# EAGLE design SPv2 (EAGLE 6.5.0)

## Sheet 1 of 2
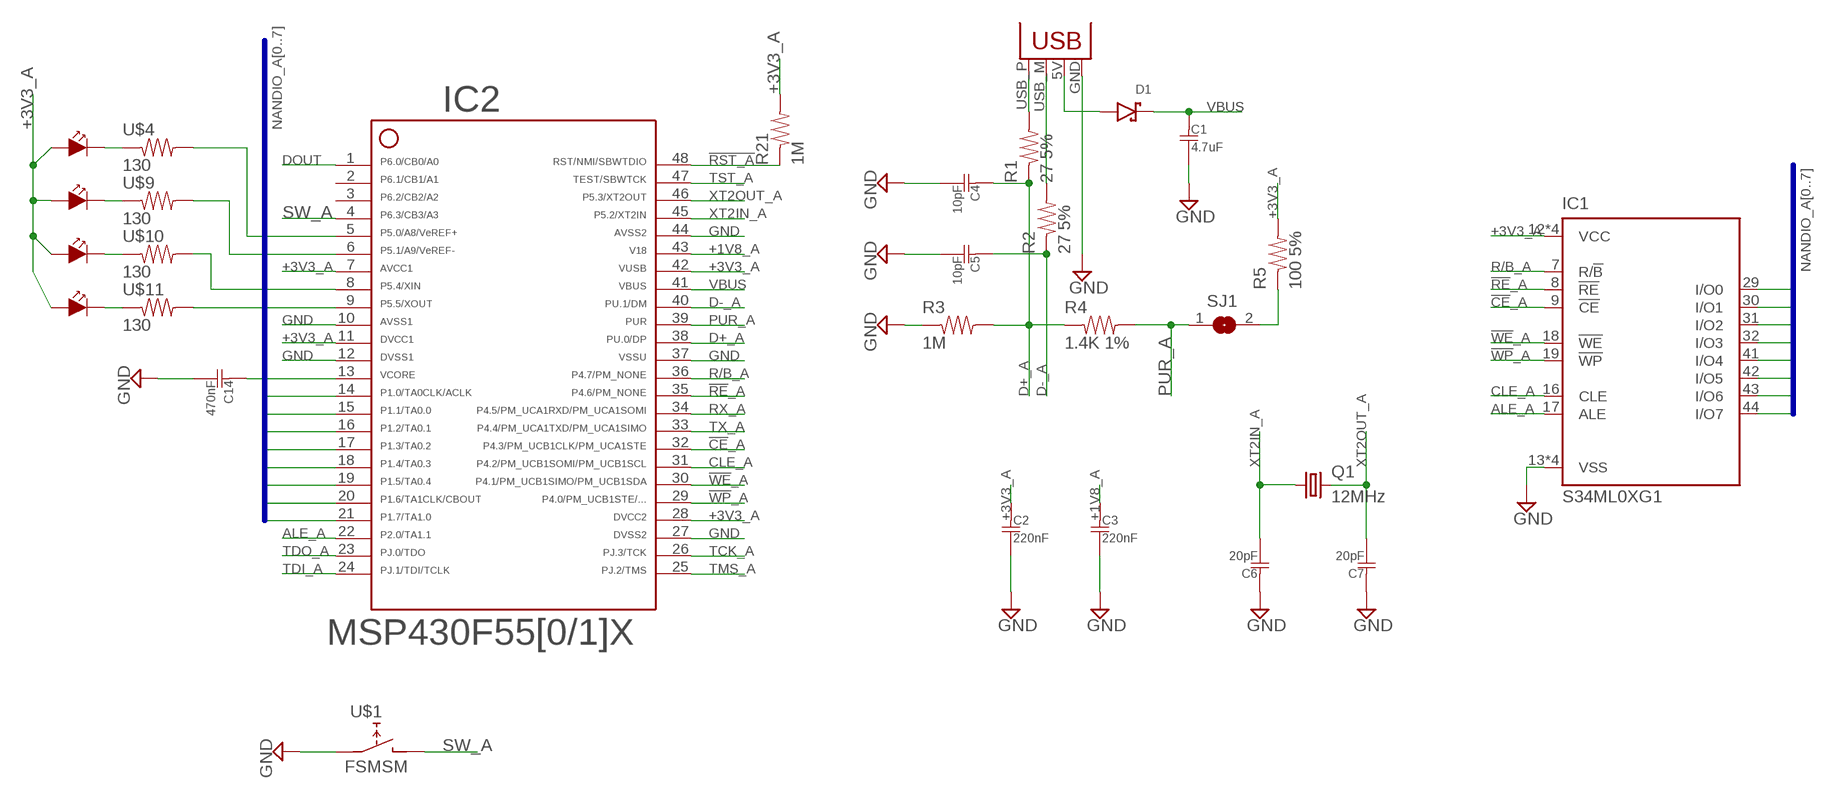
[diagram p0: schematic, sheet 1]

### Parts
C1  4.7uF  C0805  [R0805]
C2  220nF  C0805  [R0805]
C3  220nF  C0805  [R0805]
C4  10pF  C0805  [R0805]
C5  10pF  C0805  [R0805]
C6  20pF  C0805  [R0805]
C7  20pF  C0805  [R0805]
C14  470nF  C0805  [R0805]
D1  D-SCHOTTKY  [SOD123]
IC1  S34ML0XG1  [TSOP48]
IC2  F5508  F55[0/1]X---PT48  [PT48]
JP1  USBPCB  [USB-A-PCB]
Q1  12MHz  CRYSTALCSM-3X  [CSM-3X]
R1  27 5%  R0805  [R0805]
R2  27 5%  R0805  [R0805]
R3  1M  R0805  [R0805]
R4  1.4K 1%  R0805  [R0805]
R5  100 5%  R0805  [R0805]
R21  1M  R0805  [R0805]
SJ1  SJW  [SJW]
U$1  FSMSM  [FSMSM]
U$4  130  R0805  [R0805]
U$5  LED  [LED0805]
U$6  LED  [LED0805]
U$7  LED  [LED0805]
U$8  LED  [LED0805]
U$9  130  R0805  [R0805]
U$10  130  R0805  [R0805]
U$11  130  R0805  [R0805]

### Nets
!CE!_A: IC1.9(!CE) IC2.32
!RE!_A: IC1.8(!RE) IC2.35
!RST_A!: IC2.48 R21.P$1
!WE!_A: IC1.18(!WE) IC2.30
!WP!_A: IC1.19(!WP) IC2.29
+1V8_A: C3.P$1 IC2.43
+3V3_A: C2.P$1 IC1.12(VCC) IC1.34(VCC) IC1.37(VCC) IC1.39(VCC) IC2.7 IC2.11 IC2.28 IC2.42 R5.P$2 R21.P$2 U$5.ANODE U$6.ANODE U$7.ANODE U$8.ANODE
ALE_A: IC1.17(ALE) IC2.22
CLE_A: IC1.16(CLE) IC2.31
D+_A: C4.P$1 IC2.38 R1.P$1 R3.P$2 R4.P$1
D-_A: C5.P$1 IC2.40 R2.P$1
DOUT: IC2.1 ; also sheet 2
GND: C1.P$2 C2.P$2 C3.P$2 C4.P$2 C5.P$2 C6.P$1 C7.P$1 C14.P$2 IC1.13(VSS) IC1.25(VSS) IC1.36(VSS) IC1.48(VSS) IC2.10 IC2.12 IC2.27 IC2.37 IC2.44 JP1.GND R3.P$1 U$1.P$1(A1) ; also sheet 2
N$1: JP1.USB_P(D+) R1.P$2
N$2: JP1.USB_M(D-) R2.P$2
N$3: C14.P$1 IC2.13
N$4: R5.P$1 SJ1.2
N$19: IC2.9 U$11.P$2
N$22: U$7.CATHODE U$10.P$1
N$23: U$6.CATHODE U$9.P$1
N$24: U$4.P$1 U$5.CATHODE
N$25: U$8.CATHODE U$11.P$1
N$26: IC2.8 U$10.P$2
N$27: IC2.6 U$9.P$2
N$28: IC2.5 U$4.P$2
N$33: D1.ANODE JP1.5V(VBUS)
NANDIO_A0: IC1.29(I/O0) IC2.14
NANDIO_A1: IC1.30(I/O1) IC2.15
NANDIO_A2: IC1.31(I/O2) IC2.16
NANDIO_A3: IC1.32(I/O3) IC2.17
NANDIO_A4: IC1.41(I/O4) IC2.18
NANDIO_A5: IC1.42(I/O5) IC2.19
NANDIO_A6: IC1.43(I/O6) IC2.20
NANDIO_A7: IC1.44(I/O7) IC2.21
PUR_A: IC2.39 R4.P$2 SJ1.1
R/B_A: IC1.7(R/!B) IC2.36
RX_A: IC2.34 ; also sheet 2
SW_A: IC2.4 U$1.P$2(B)
TCK_A: IC2.26
TDI_A: IC2.24
TDO_A: IC2.23
TMS_A: IC2.25
TST_A: IC2.47
TX_A: IC2.33 ; also sheet 2
VBUS: C1.P$1 D1.CATHODE IC2.41 ; also sheet 2
XT2IN_A: C6.P$2 IC2.45 Q1.P$1
XT2OUT_A: C7.P$2 IC2.46 Q1.P$2
Unconnected: IC2.2 IC2.3

### Buses
NANDIO_A[0..7]

## Sheet 2 of 2
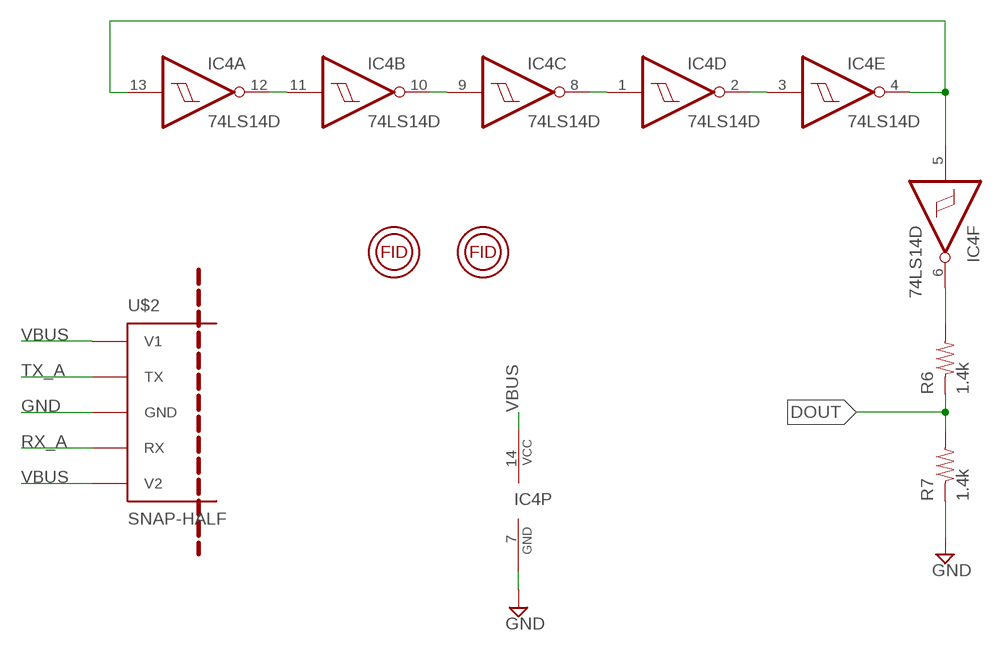
[diagram p1: schematic, sheet 2]

### Parts
IC4  74LS14D  [SO14]
R6  1.4k  R0805  [R0805]
R7  1.4k  R0805  [R0805]
U$2  SNAP-HALF  [SNAP-HALF]
U$3  FIDUCAL  [FIDUCAL]
U$12  FIDUCAL  [FIDUCAL]

### Nets
DOUT: R6.P$1 R7.P$2 ; also sheet 1
GND: IC4.7(P:GND) R7.P$1 U$2.P$3(GND) ; also sheet 1
N$5: IC4.11(B:I) IC4.12(A:O)
N$6: IC4.9(C:I) IC4.10(B:O)
N$7: IC4.1(D:I) IC4.8(C:O)
N$8: IC4.2(D:O) IC4.3(E:I)
N$9: IC4.4(E:O) IC4.5(F:I) IC4.13(A:I)
N$10: IC4.6(F:O) R6.P$2
RX_A: U$2.P$4(RX) ; also sheet 1
TX_A: U$2.P$2(TX) ; also sheet 1
VBUS: IC4.14(P:VCC) U$2.P$1(V1) U$2.P$5(V2) ; also sheet 1

## Library data of the parts
C1-C7 C14 = Passives:C
D1 = Passives:D-SCHOTTKY
IC1 = Flash:S34ML0XG1: Spansion 1GB, 2GB, and 4GB x8 NAND Flash Memory In x8 I/O mode
IC2 = TI_MSP430_v16:F55[0/1]X---PT48: ***F55[0/1/2]X*** PT48 Rev. 1.0 06/2010 "http://www.ti.com/lit/gpn/msp430f5509" Only for FF5504, F5508,F5509,F5510
IC4 = 74xx-us:74*14: Hex schmitt trigger INVERTER
JP1 = SparkFun-Connectors:USB: USB Connectors USB-B-PTH is fully proven SKU : PRT-00139/CONN-08278 USB-miniB is fully proven SKU : PRT-00587 USB-A-PCB is untested. USB-A-H is throughly reviewed, but untested. Spark Fun Electronics SKU : PRT-00437 USB-B-SMT is throughly reviewed, but untested. Needs silkscreen touching up. USB-A-S has not been used/tested USB-MB-H has not been used/tested USB-MICROB has been used. CONN-09505
Q1 = Passives:CRYSTAL: CRYSTAL
R1-R7 R21 U$4 U$9-U$11 = Passives:R: A standard resistor.
SJ1 = jumper:SJ: SMD solder JUMPER
U$1 = Passives:FSMSM
U$2 = Passives:SNAP-HALF
U$3 U$12 = Passives:FIDUCAL
U$5-U$8 = Passives:LED

## Board
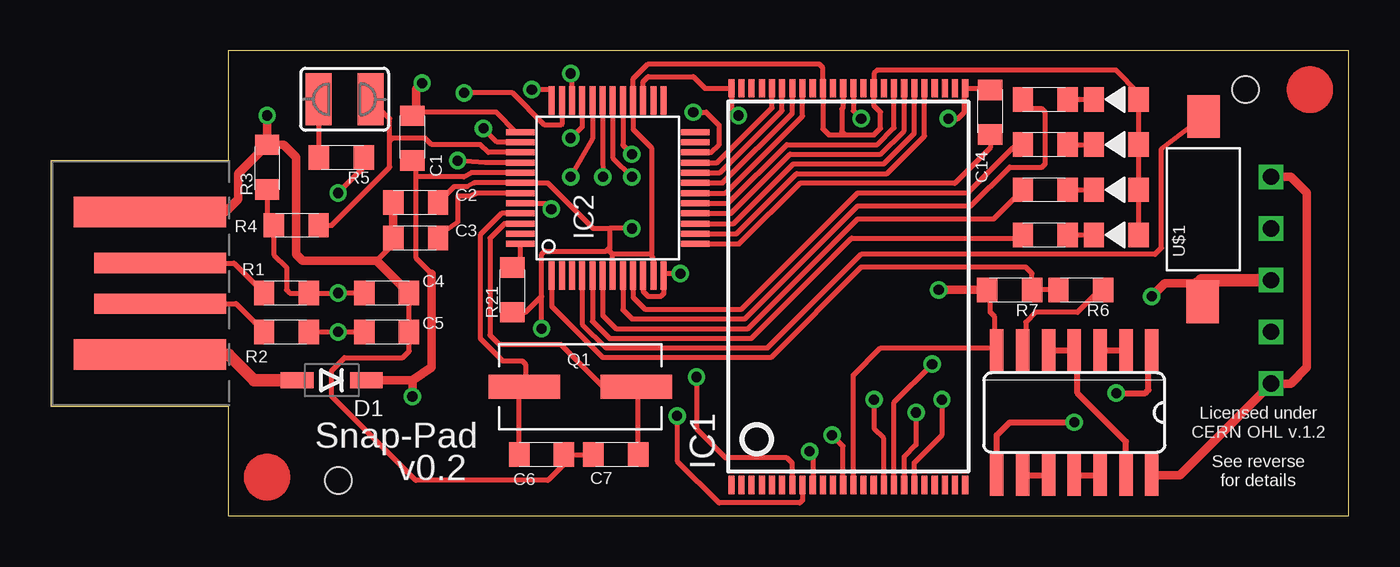
[diagram p2: board, top side]
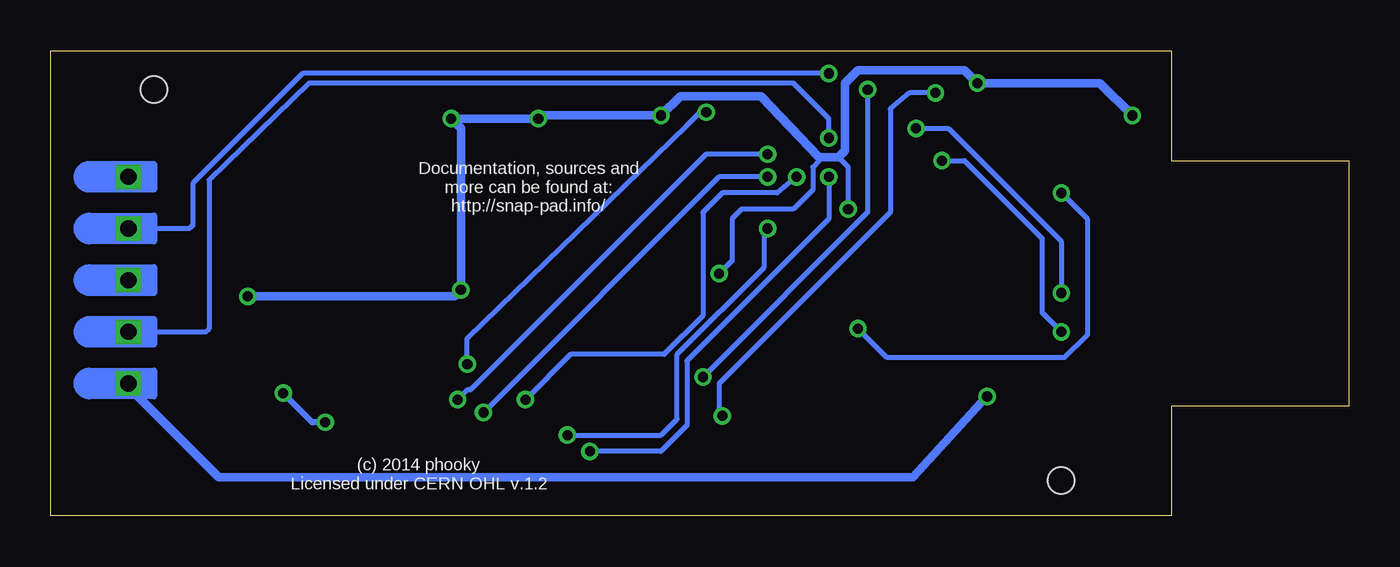
[diagram p3: board, bottom side, seen from below]

Size 63.82 x 22.86 mm. Coordinates in mm from the lower left corner, seen from the top.
Outline: 8.73,0 63.82,0 63.82,22.86 8.73,22.86 8.73,17.46 0,17.46 0,5.4 8.73,5.4 8.73,0
Copper layers (1*16): Top 0.0356mm / dielectric 1.5011mm / Bottom 0.0356mm
Design rules "LaenPCBOrder": minimum track width 6mil, minimum drill 13mil, track to track 6mil, track to pad 6mil, pad to pad 6mil, via to via 6mil, smd to smd 6mil, copper to edge 15mil, drill to drill 6mil, minimum pad ring 7mil, minimum via ring 7mil, stop-mask expansion 3mil, vias tented up to drill 0mil, thermal gap 10mil
Holes 1.3 mm at 14.13,1.75 58.74,20.95

### Footprints (pad centres in the part's own frame; a part is rotated, then mirrored left to right if it is on the bottom)
R0805 = smd 1 x 1.2: P$1 1.1,0; P$2 -1.1,0
SOD123 = smd 1.6 x 0.8: ANODE 1.7,0; CATHODE -1.7,0
TSOP48 = smd 0.9 x 0.3: 1 -9.75,5.75; 2 -9.75,5.25; 3 -9.75,4.75; 4 -9.75,4.25; 5 -9.75,3.75; 6 -9.75,3.25; 7 -9.75,2.75; 8 -9.75,2.25; 9 -9.75,1.75; 10 -9.75,1.25; 11 -9.75,0.75; 12 -9.75,0.25; 13 -9.75,-0.25; 14 -9.75,-0.75; 15 -9.75,-1.25; 16 -9.75,-1.75; 17 -9.75,-2.25; 18 -9.75,-2.75; 19 -9.75,-3.25; 20 -9.75,-3.75; 21 -9.75,-4.25; 22 -9.75,-4.75; 23 -9.75,-5.25; 24 -9.75,-5.75; 25 9.75,-5.75; 26 9.75,-5.25; 27 9.75,-4.75; 28 9.75,-4.25; 29 9.75,-3.75; 30 9.75,-3.25; 31 9.75,-2.75; 32 9.75,-2.25; 33 9.75,-1.75; 34 9.75,-1.25; 35 9.75,-0.75; 36 9.75,-0.25; 37 9.75,0.25; 38 9.75,0.75; 39 9.75,1.25; 40 9.75,1.75; 41 9.75,2.25; 42 9.75,2.75; 43 9.75,3.25; 44 9.75,3.75; 45 9.75,4.25; 46 9.75,4.75; 47 9.75,5.25; 48 9.75,5.75
PT48 = smd 1.4 x 0.3: 1 -4.3,2.75; 2 -4.3,2.25; 3 -4.3,1.75; 4 -4.3,1.25; 5 -4.3,0.75; 6 -4.3,0.25; 7 -4.3,-0.25; 8 -4.3,-0.75; 9 -4.3,-1.25; 10 -4.3,-1.75; 11 -4.3,-2.25; 12 -4.3,-2.75; 25 4.3,-2.75; 26 4.3,-2.25; 27 4.3,-1.75; 28 4.3,-1.25; 29 4.3,-0.75; 30 4.3,-0.25; 31 4.3,0.25; 32 4.3,0.75; 33 4.3,1.25; 34 4.3,1.75; 35 4.3,2.25; 36 4.3,2.75 | smd 0.3 x 1.4: 13 -2.75,-4.3; 14 -2.25,-4.3; 15 -1.75,-4.3; 16 -1.25,-4.3; 17 -0.75,-4.3; 18 -0.25,-4.3; 19 0.25,-4.3; 20 0.75,-4.3; 21 1.25,-4.3; 22 1.75,-4.3; 23 2.25,-4.3; 24 2.75,-4.3; 37 2.75,4.3; 38 2.25,4.3; 39 1.75,4.3; 40 1.25,4.3; 41 0.75,4.3; 42 0.25,4.3; 43 -0.25,4.3; 44 -0.75,4.3; 45 -1.25,4.3; 46 -1.75,4.3; 47 -2.25,4.3; 48 -2.75,4.3
SO14 = smd 0.66 x 2.032: 1 -3.81,-3.073; 2 -2.54,-3.073; 3 -1.27,-3.073; 4 0,-3.073; 5 1.27,-3.073; 6 2.54,-3.073; 7 3.81,-3.073; 8 3.81,3.073; 9 2.54,3.073; 10 1.27,3.073; 11 0,3.073; 12 -1.27,3.073; 13 -2.54,3.073; 14 -3.81,3.073
USB-A-PCB = smd 7.5 x 1.5: 5V -0.2,-3.5; GND -0.2,3.5 | smd 6.5 x 1: USB_M 0.3,-1; USB_P 0.3,1
CSM-3X = smd 3.5 x 1.2: P$1 -2.75,0; P$2 2.75,0
SJW = smd 1.27 x 2.54: 1 -1.27,0; 2 1.27,0
FSMSM = smd 2.1 x 1.6: P$1 -4.55,0.05; P$2 4.55,0
SNAP-HALF = drill 0.8 square: P$1 -3.81,5.08; P$2 -3.81,2.54; P$3 -3.81,0; P$4 -3.81,-2.54; P$5 -3.81,-5.08
LED0805 = smd 1 x 1.2: ANODE -1.1,0; CATHODE 1.1,0

### Placement (x,y rotation side)
C1  17.78,18.57 270 top
C2  17.94,15.4 0 top
C3  17.94,13.65 0 top
C4  16.51,10.95 180 top
C5  16.51,9.05 180 top
C6  24.13,3.02 0 top
C7  27.78,3.02 180 top
C14  46.2,19.84 270 top
D1  13.81,6.67 180 top
IC1  39.21,11.27 90 top
IC2  27.38,16.12 90 top
IC4  50.32,5.08 180 top
JP1  5.08,11.43 0 top
Q1  26.04,6.35 0 top
R1  11.59,10.95 0 top
R2  11.59,9.05 0 top
R3  10.64,17.14 90 top
R4  12.06,14.29 180 top
R5  14.29,17.62 180 top
R6  50.64,11.11 180 top
R7  47.15,11.11 180 top
R21  22.7,11.11 90 top
SJ1  14.45,20.48 180 top
U$1  56.67,15.08 90 top
U$2  63.82,11.59 180 bottom
U$3  10.64,1.91 0 top
U$4  48.9,13.81 0 top
U$5  52.39,13.81 180 top
U$6  52.39,16.03 180 top
U$7  52.39,20.48 180 top
U$8  52.39,18.26 180 top
U$9  48.9,16.03 0 top
U$10  48.9,20.48 0 top
U$11  48.9,18.26 0 top
U$12  61.91,20.95 0 top

### Tracks (layer width: path | path; a pad name or v marks a point on that pad's centre or on a via)
!CE!_A  (via drill 0.5)
  Top 0.254: IC2.32 26.63,18.53 v25.56,16.67 | v37.31,3.17 37.47,3.02 IC1.9
  Bottom 0.254: v25.56,16.67 25.56,14.61 32.54,7.62 32.54,4.45 33.81,3.17 v37.31,3.17
!RE!_A  (via drill 0.5)
  Top 0.254: IC2.35 25.13,19.25 25.08,19.21 24.29,19.21 22.7,20.8 v20.32,20.8 | v30.8,4.92 30.8,2.7 32.86,0.64 36.83,0.64 36.96,0.77 IC1.8
  Bottom 0.254: v20.32,20.8 21.59,20.8 22.54,20 22.54,14.92 30.96,6.51 30.96,5.08 v30.8,4.92
!RST_A!
  Top 0.254: IC2.48 23.08,12.59 R21.P$1
!WE!_A  (via drill 0.5)
  Top 0.254: IC2.30 27.63,17.61 v28.57,16.67 | v42.55,5.08 42.55,3.49 41.96,2.91 IC1.18
  Bottom 0.254: v28.57,16.67 30.96,16.67 v42.55,5.08
!WP!_A  (via drill 0.5)
  Top 0.254: IC2.29 28.13,18.23 v28.57,17.78 | v43.81,5.71 43.81,3.97 42.46,2.62 IC1.19
  Bottom 0.254: v28.57,17.78 31.59,17.78 43.18,6.19 43.34,6.19 v43.81,5.71
+1V8_A
  Top 0.254: IC2.43 20.95,15.87 20.64,15.72 20,15.72 20,14.45 19.37,13.98 C3.P$1
+3V3_A  (via drill 0.5)
  Top 0.254: IC2.11 29.63,12.6 29.53,12.86 | 29.53,12.86 27.62,12.86 | IC2.7 27.63,12.55 27.62,12.86 | U$5.ANODE U$6.ANODE U$8.ANODE U$7.ANODE 53.49,20.81 52.39,21.91 40.64,21.91 40.48,21.75 40.48,21.04 IC1.34 40.48,21 40.48,20.16 40.8,19.84 40.8,19.05 40.48,18.73 39.05,18.73 | IC1.37 38.96,20.07 38.89,20 38.89,18.89 39.05,18.73 | 39.05,18.73 38.26,18.73 37.96,19.03 IC1.39 37.94,21.04 37.94,22.07 37.78,22.23 29.37,22.23 28.63,21.48 IC2.28 28.63,19 29.53,18.1 29.53,12.86 | C2.P$1 19.83,16.19 20.48,16.19 20.81,16.37 IC2.42 24.43,16.37 26.67,14.13 27.46,14.13 | 27.62,12.86 27.46,13.02 27.46,13.18 | 27.46,14.13 27.46,13.18 | IC1.12 38.96,3.42 v38.42,3.97 | v28.57,14.13 27.46,14.13 | R21.P$2 23.35,10.01 24.13,10.79 | 24.13,10.79 24.13,12.86 24.29,13.02 27.3,13.02 27.46,13.18 | R5.P$2 15.39,17.13 v14.13,15.88 | v24.13,9.21 24.13,10.79
  Bottom 0.254: v38.42,3.97 33.81,3.97 33.02,4.76 33.02,7.94 28.73,12.22 28.73,13.97 v28.57,14.13 | v14.13,15.88 12.86,14.61 12.86,8.89 13.97,7.78 22.7,7.78 v24.13,9.21
ALE_A  (via drill 0.5)
  Top 0.254: IC1.17 41.46,5.58 v43.34,7.46 | v31.59,19.84 32.23,19.84 32.86,19.21 32.86,18.26 32.47,17.87 IC2.22
  Bottom 0.254: v43.34,7.46 43.34,8.73 32.54,19.21 31.91,19.84 v31.59,19.84
CLE_A  (via drill 0.5)
  Top 0.254: IC2.31 27.13,17.76 v27.15,16.67 | IC1.16 40.96,3.81 40.48,4.29 v40.48,5.71
  Bottom 0.254: v27.15,16.67 28.1,15.88 30.8,15.88 31.75,14.92 31.75,9.84 33.66,7.94 38.26,7.94 v40.48,5.71
D+_A  (via drill 0.5)
  Top 0.254: C4.P$1 v14.13,10.95 R1.P$1 11.75,10.95 11.59,11.11 11.59,12.22 10.96,12.85 R4.P$1 10.64,14.62 R3.P$2 | IC2.38 21.95,18.37 v21.27,19.05
  Bottom 0.254: 14.13,11.34 v14.13,10.95 14.13,13.49 19.68,19.05 v21.27,19.05
D-_A  (via drill 0.5)
  Top 0.254: IC2.40 21.37,17.37 v20,17.46 | C5.P$1 v14.13,9.05 R2.P$1
  Bottom 0.254: v20,17.46 18.89,17.46 15.08,13.65 15.08,10 v14.13,9.05
DOUT
  Top 0.254: IC2.1 24.63,10.3 26.99,7.94 27.15,7.78 35.4,7.78 39.85,12.22 47.94,12.22 48.25,11.92 R7.P$2 R6.P$1
GND  (via drill 0.5)
  Top 0.254: IC2.10 29.13,11.04 29.37,10.79 30,10.79 30.13,10.92 IC2.12 30.22,11.91 v30.96,11.91 | IC1.36 39.46,19.91 v39.85,19.53 | v44.13,19.53 44.61,19.53 44.93,19.84 44.93,20.99 IC1.25 46.12,21.02 C14.P$2 | IC1.13 39.46,6.92 40.8,8.26 46.41,8.26 | 46.41,8.26 IC4.7 | IC2.27 29.13,21.35 29.37,21.59 31.59,21.59 32.16,21.02 IC1.48 33.46,20.04 v33.81,19.68 | IC2.37 22.88,18.87 21.91,19.84 17.95,19.84 C1.P$2 | C4.P$2 C5.P$2 17.62,9.04 17.62,8.1 17.3,7.78 14.45,7.78 13.81,7.14 13.81,5.87 17.94,1.75 24.45,1.75 25.23,2.53 C6.P$1 C7.P$1 | 46.41,8.26 46.41,9.79 46.2,10 46.2,10.96 R7.P$1 | C3.P$2 16.84,13.36 16.02,12.54 | IC2.44 24.32,15.37 v24.61,15.08
  Top 0.406: JP1.GND 8.58,14.93 9.21,15.56 9.21,16.82 R3.P$1 | R3.P$1 11.44,18.25 12.06,17.62 12.06,12.86 12.38,12.54 16.02,12.54 C4.P$2 17.79,11.13 | C3.P$2 C2.P$2 | 56.41,11.43 54.77,11.43 v54.13,10.79 | v43.66,11.11 R7.P$1 | v10.64,19.68 R3.P$1 | 17.95,19.84 17.95,20.97 v18.26,21.27
  Top 0.61: 56.41,11.43 U$1.P$1 56.57,11.59 U$2.P$3
  Bottom 0.254: 39.69,19.68 v39.85,19.53 | 26.04,17.62 26.04,17.46 26.35,17.14 26.35,16.03 27.3,15.08 29.84,15.08 30.32,14.61 30.32,12.54 v30.96,11.91 | v24.61,15.08 24.61,17.14 25.08,17.62
  Bottom 0.406: v39.85,19.53 v44.13,19.53 43.66,19.05 v43.66,11.11 43.97,10.79 v54.13,10.79 | 39.69,19.68 v33.81,19.68 32.86,20.64 28.89,20.64 26.04,17.62 25.08,17.62 24.77,17.94 24.77,21.27 24.13,21.91 18.89,21.91 v18.26,21.27 12.22,21.27 v10.64,19.68
N$1
  Top 0.254: JP1.USB_P 9.01,12.43 R1.P$2
N$2
  Top 0.254: JP1.USB_M 9.11,10.43 R2.P$2
N$3
  Top 0.254: C14.P$1 46.2,18.1 44.45,16.35 36.83,16.35 33.85,13.37 IC2.13
N$4
  Top 0.254: SJ1.2 13.18,17.63 R5.P$1
N$5
  Top 0.305: IC4.11 IC4.12
N$6
  Top 0.305: IC4.9 IC4.10
N$7  (via drill 0.5)
  Top 0.305: IC4.8 46.51,3.97 47.15,4.6 v50.32,4.6 | v52.39,6.03 53.82,6.03 53.98,6.19 53.98,8 IC4.1
  Bottom 0.305: v50.32,4.6 50.96,4.6 v52.39,6.03
N$8
  Top 0.305: IC4.3 IC4.2
N$9
  Top 0.305: IC4.5 IC4.4 50.48,8 50.48,6.03 52.86,3.65 IC4.13
N$10
  Top 0.254: R6.P$2 51.59,11.11 50.48,10 48.42,10 47.94,9.53 47.94,8.31 IC4.6
N$19
  Top 0.254: IC2.9 28.63,10.74 29.21,10.16 33.97,10.16 39.69,15.88 45.09,15.88 47.31,18.1 47.64,18.1 U$11.P$2
N$22
  Top 0.254: U$10.P$1 U$7.CATHODE
N$23
  Top 0.254: U$9.P$1 U$6.CATHODE
N$24
  Top 0.254: U$4.P$1 U$5.CATHODE
N$25
  Top 0.254: U$11.P$1 U$8.CATHODE
N$26
  Top 0.254: IC2.8 28.13,10.13 28.57,9.68 34.13,9.68 39.69,15.24 45.24,15.24 47.15,17.14 48.74,17.14 48.9,17.3 48.9,19.84 48.74,20 48.27,20 U$10.P$2
N$27
  Top 0.254: IC2.6 27.13,9.86 27.78,9.21 34.29,9.21 39.69,14.61 46.37,14.61 U$9.P$2
N$28
  Top 0.254: IC2.5 26.63,9.57 27.46,8.73 34.45,8.73 39.37,13.65 47.48,13.65 U$4.P$2
N$33
  Top 0.61: JP1.5V 8.74,7.93 10,6.67 D1.ANODE
NANDIO_A0
  Top 0.254: IC2.14 33.71,13.87 36.67,16.83 41.12,16.83 42.96,18.67 IC1.29
NANDIO_A1
  Top 0.254: IC2.15 33.58,14.37 36.51,17.3 40.96,17.3 42.46,18.81 IC1.30
NANDIO_A2
  Top 0.254: IC2.16 33.44,14.87 36.35,17.78 40.8,17.78 41.96,18.94 IC1.31
NANDIO_A3
  Top 0.254: IC2.17 33.31,15.37 36.2,18.26 40.64,18.26 41.46,19.08 IC1.32
NANDIO_A4
  Top 0.254: IC2.18 33.17,15.87 36.96,19.66 IC1.41
NANDIO_A5
  Top 0.254: IC2.19 33.04,16.37 36.46,19.79 IC1.42
NANDIO_A6
  Top 0.254: IC2.20 32.9,16.87 35.96,19.93 IC1.43
NANDIO_A7
  Top 0.254: IC2.21 32.77,17.37 35.46,20.06 IC1.44
PUR_A
  Top 0.254: IC2.39 21.5,17.87 21.11,18.26 18.73,18.26 18.41,18.57 16.83,18.57 16.67,18.41 | 16.67,18.41 16.67,19.53 SJ1.1 | R4.P$2 13.81,14.29 16.67,17.14 16.67,18.41
R/B_A  (via drill 0.5)
  Top 0.254: IC2.36 24.63,20.61 24.61,20.95 v23.65,20.95 | v31.75,6.83 31.75,4.29 33.18,2.86 36.2,2.86 36.46,2.59 IC1.7
  Bottom 0.254: v23.65,20.95 23.65,14.92 v31.75,6.83
RX_A  (via drill 0.5)
  Top 0.254: IC2.34 25.63,21.36 v25.56,21.75
  Bottom 0.254: v25.56,21.75 51.44,21.75 56.83,16.35 56.83,14.29 56.99,14.13 U$2.P$4
SW_A
  Top 0.254: IC2.4 26.13,9.43 27.3,8.26 35.24,8.26 39.85,12.86 54.29,12.86 54.61,13.18 54.61,18.04 U$1.P$2
TX_A  (via drill 0.5)
  Top 0.254: IC2.33 26.13,19.11 v25.56,18.57
  Bottom 0.254: v25.56,18.57 25.56,19.53 27.3,21.27 51.12,21.27 56.04,16.51 56.04,9.21 56.2,9.05 U$2.P$2
VBUS  (via drill 0.5)
  Top 0.254: IC2.41 20.68,16.87 20.32,16.67 17.94,16.67 | 17.94,16.67 17.94,12.7 18.73,11.91 | C1.P$1 17.93,17.47 17.94,17.46 17.94,16.67
  Top 0.406: D1.CATHODE 17.78,6.67 | 18.73,11.91 18.73,7.3 17.78,6.67 | U$2.P$5 60.96,16.67 61.75,15.88 61.75,7.3 60.96,6.51 U$2.P$1 55.51,2.01 IC4.14 | v17.78,5.87 17.78,6.67
  Bottom 0.406: U$2.P$1 60.01,6.35 55.56,1.91 21.43,1.91 v17.78,5.87
XT2IN_A
  Top 0.254: IC2.45 22.17,14.87 21.11,13.81 21.11,8.73 22.23,7.62 23.18,7.62 23.34,7.46 23.34,6.4 Q1.P$1 23.03,6.09 C6.P$2
XT2OUT_A
  Top 0.254: IC2.46 22.31,14.37 21.59,13.65 21.59,8.89 22.07,8.41 25.08,8.41 27.15,6.35 Q1.P$2 28.88,6.25 C7.P$2

### Text on the board
tPlace: Licensed under / CERN OHL v.1.2 | Snap-Pad | v0.2 | See reverse / for details
bPlace: Documentation, sources and / more can be found at: / http://snap-pad.info/ | (c) 2014 phooky / Licensed under CERN OHL v.1.2